# EasyEDA Pro project PRJ_Feeder.epro, schematic MainBoard

## Sheets
1 Power: Board Name: Feeder; Create Date: 2025-01-08; Page Name: Power; Project Name: Orion-Feeder; Schematic Name: MainBoard; Update Date: 2025-01-09; Company: EasyEDA.com; Page Size: A4; Version: V0.1b
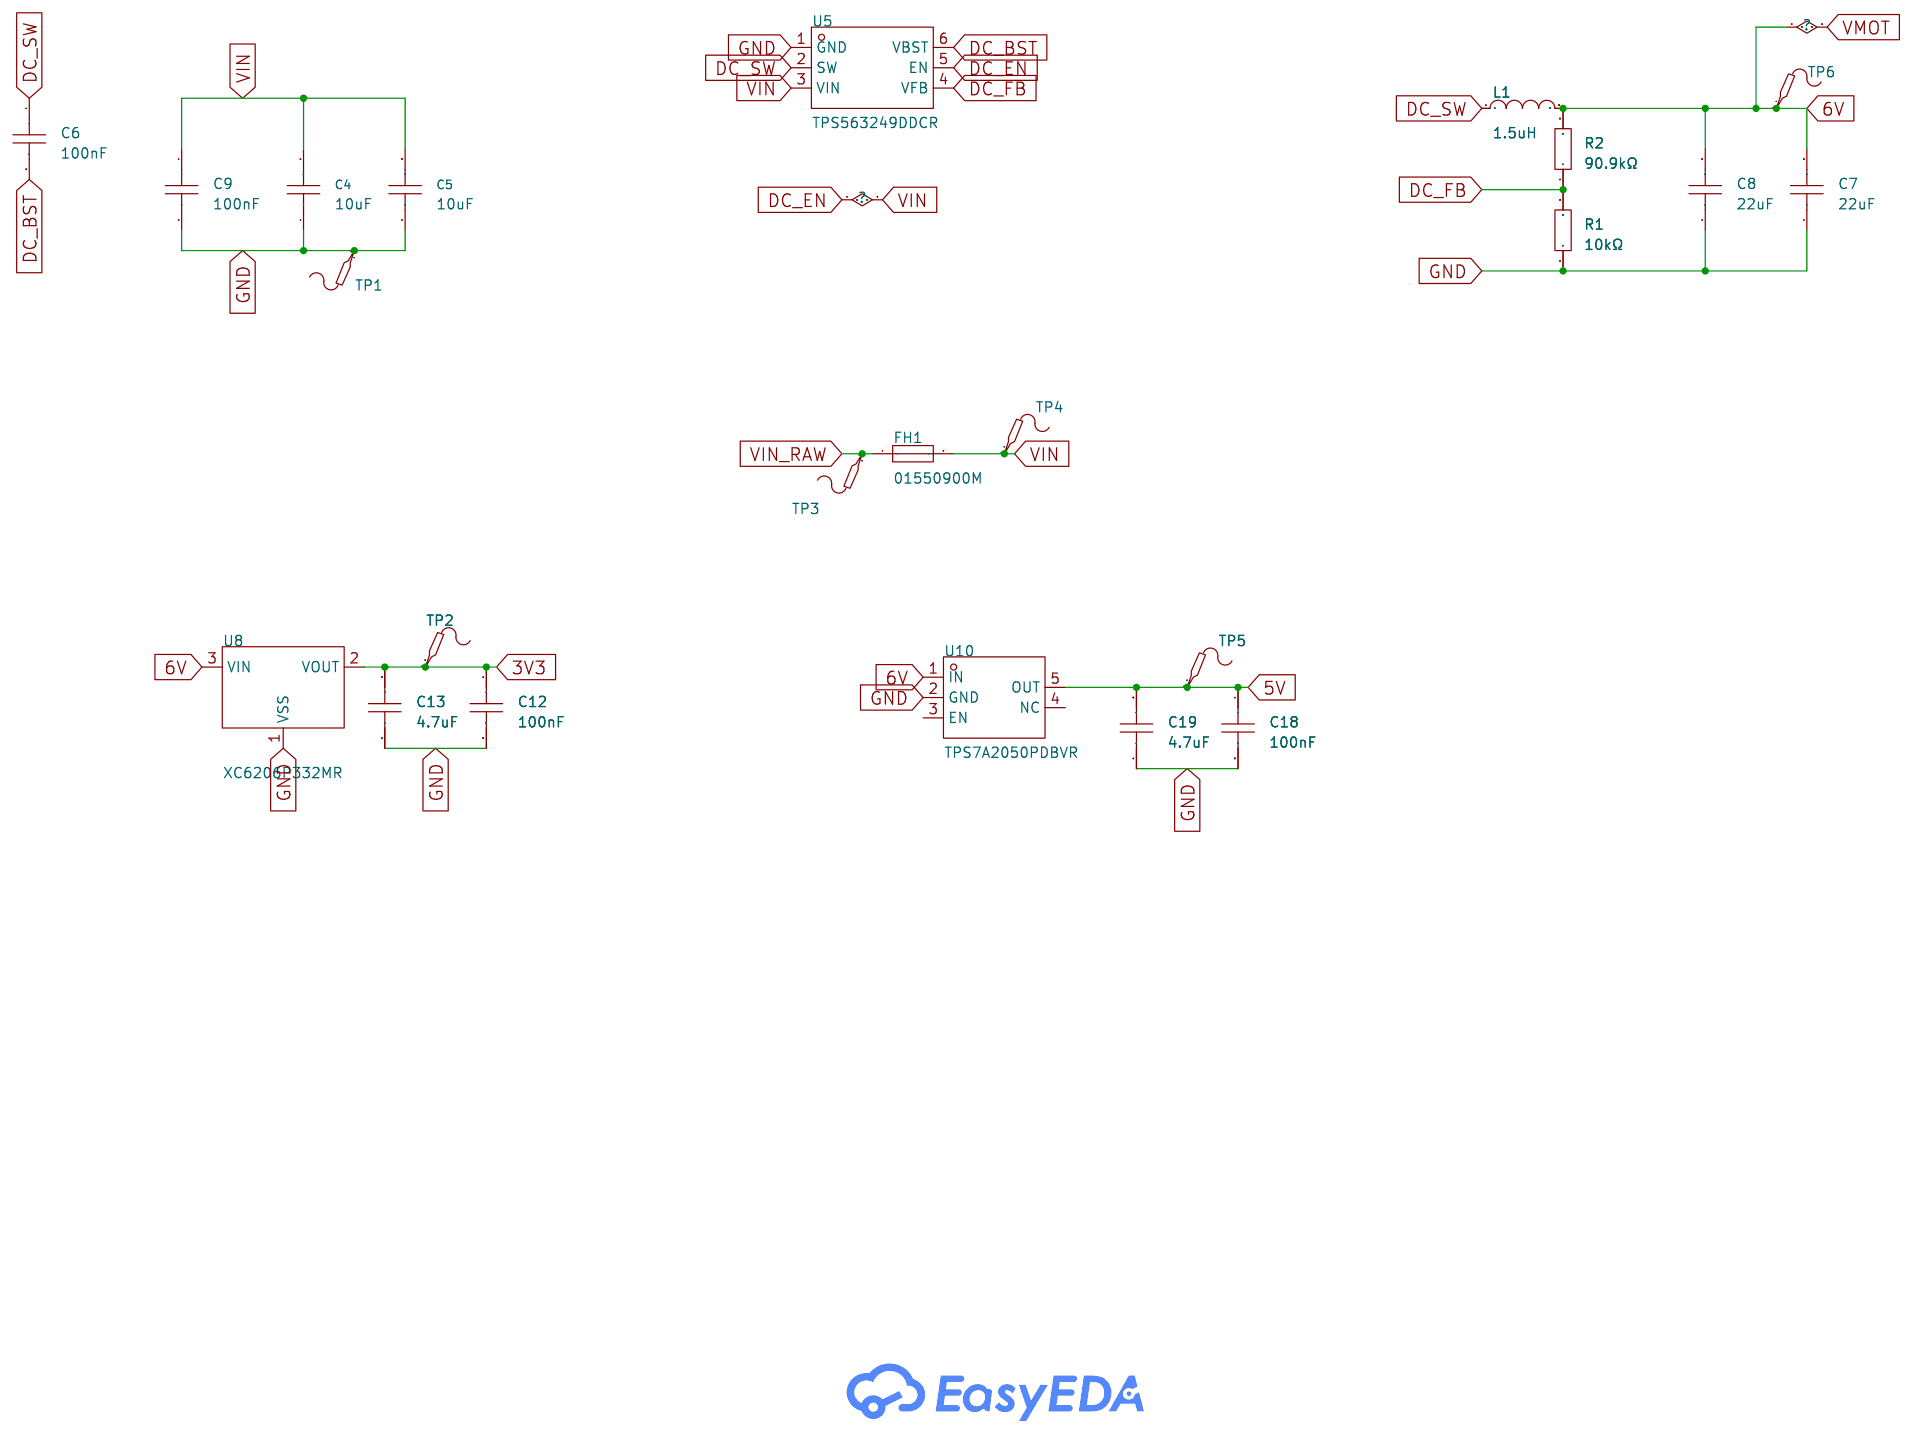
[diagram p0: Power]
2 MCU: Page Name: MCU
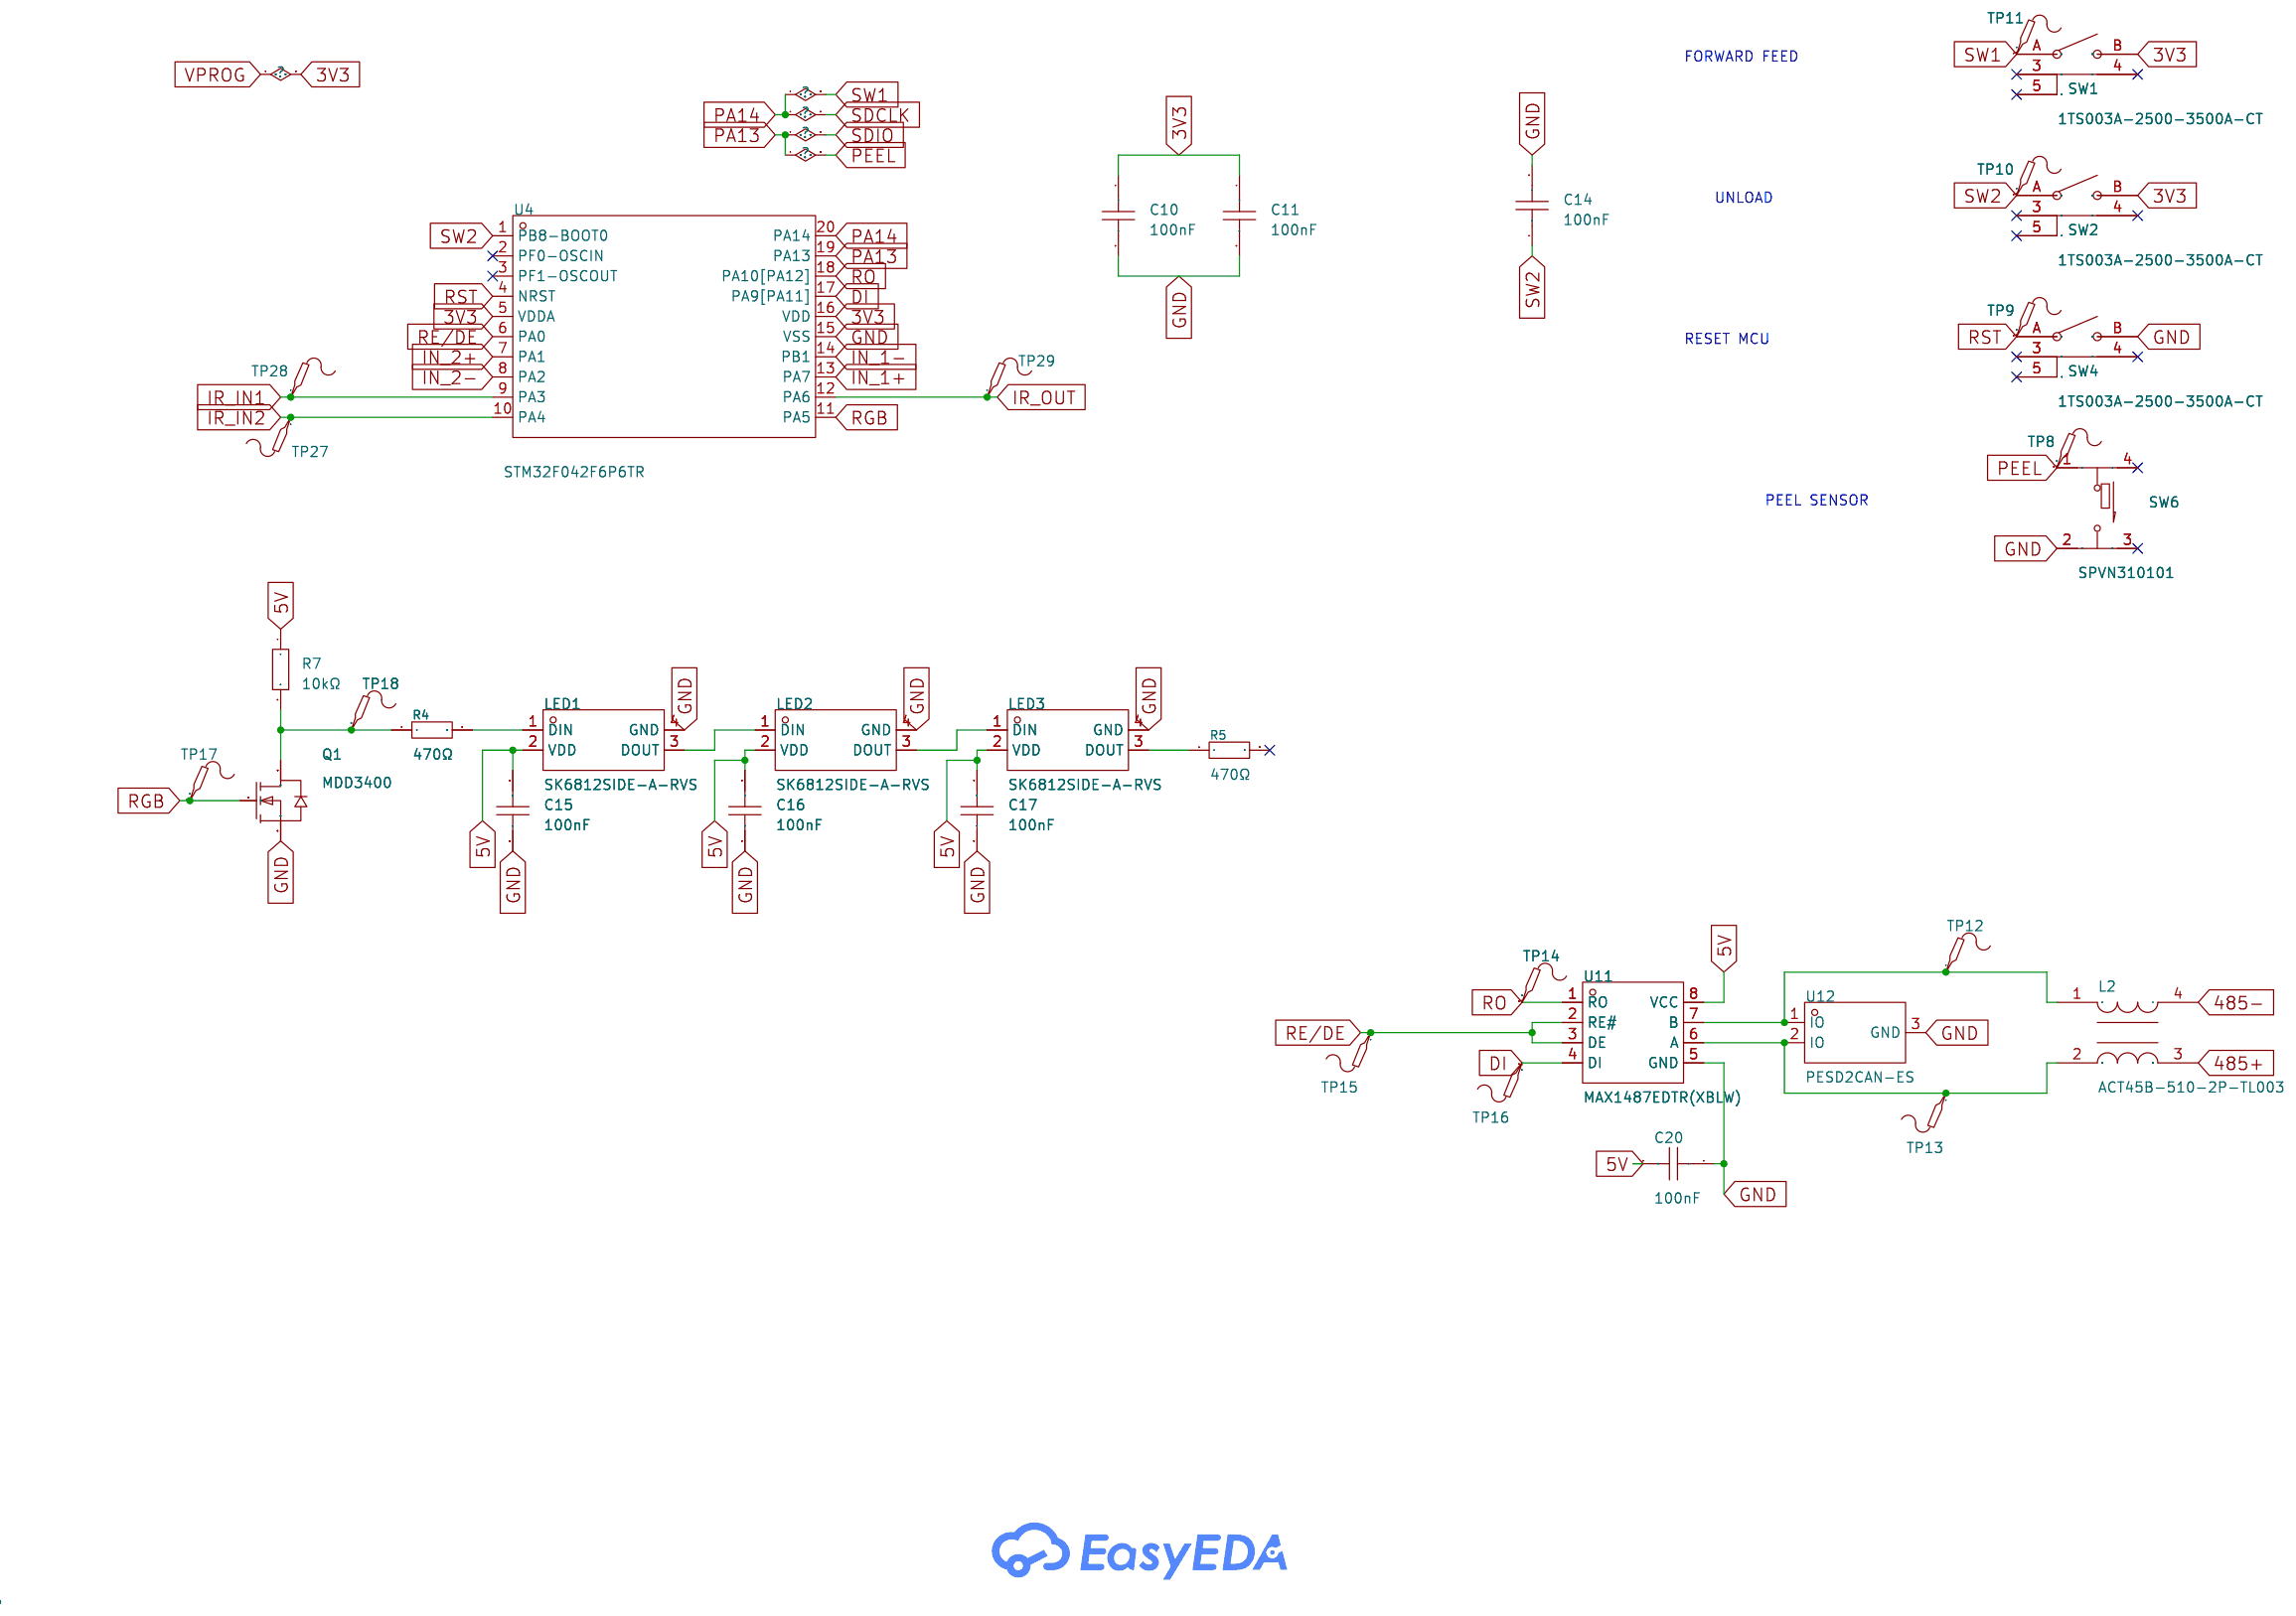
[diagram p1: MCU]
3 Motor: Page Name: Motor; Update Date: 2025-03-19
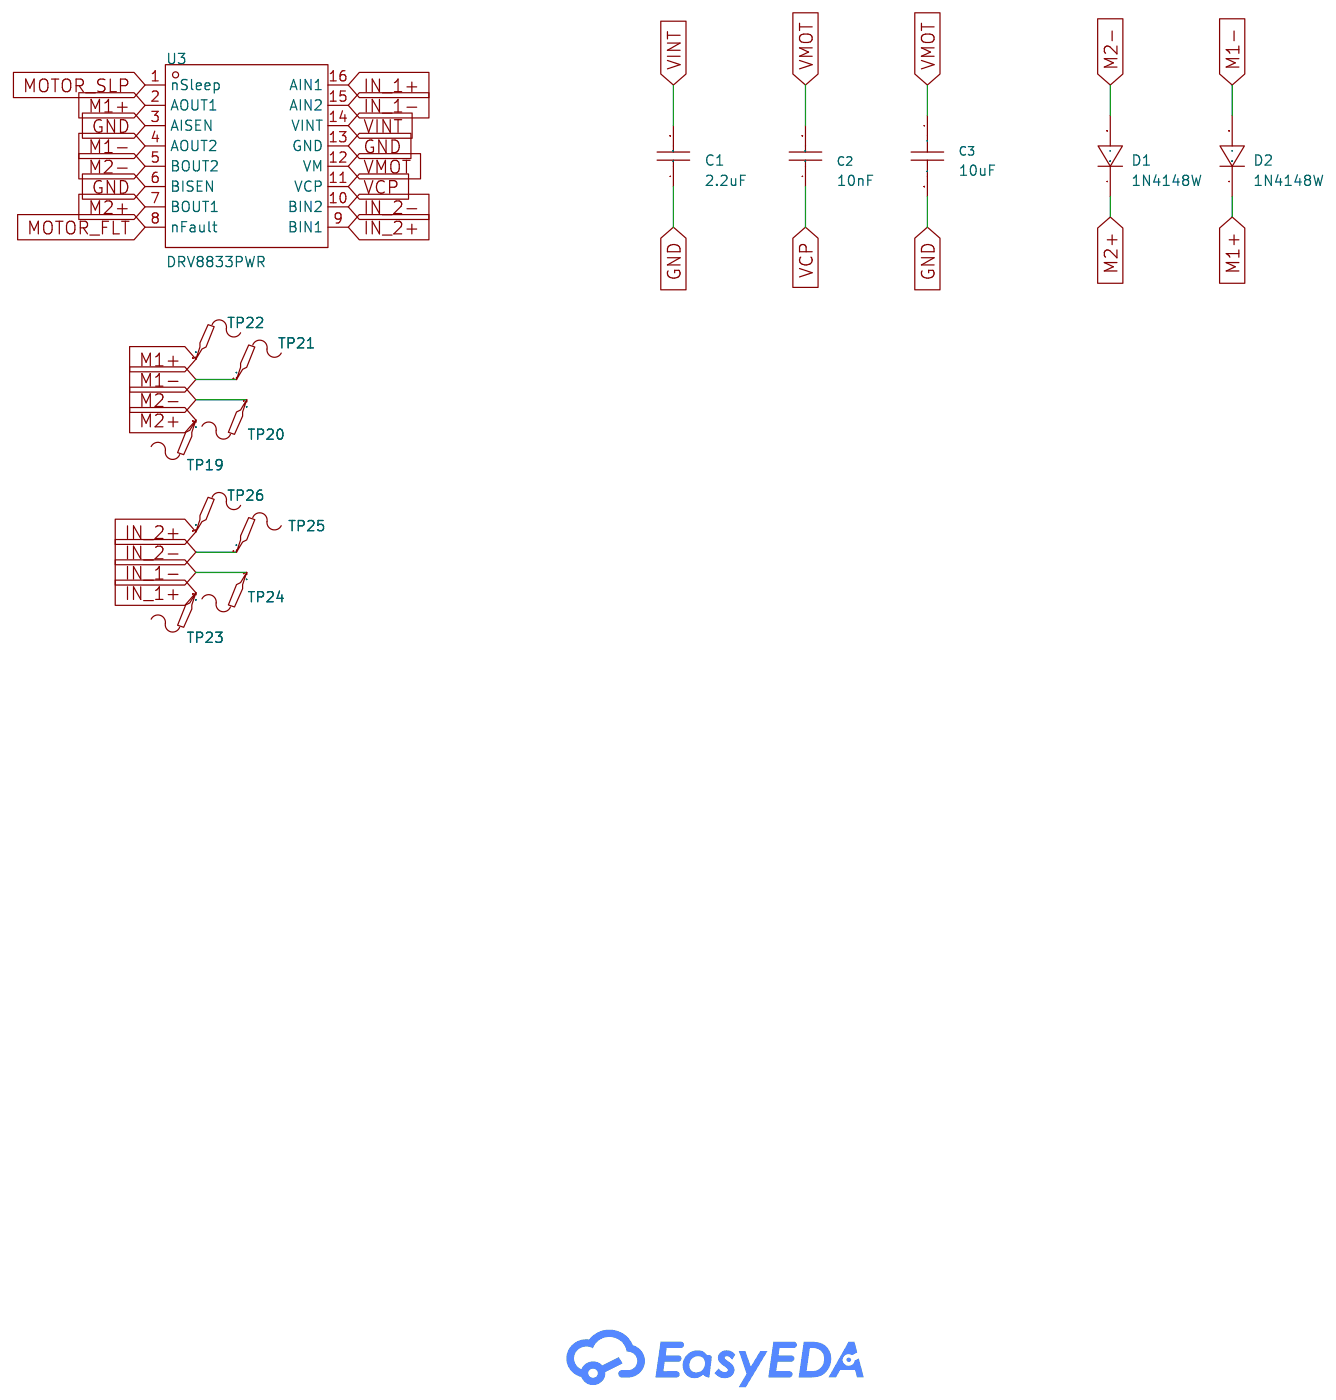
[diagram p2: Motor]
4 Connectors: Page Name: Connectors; Update Date: 2025-01-08
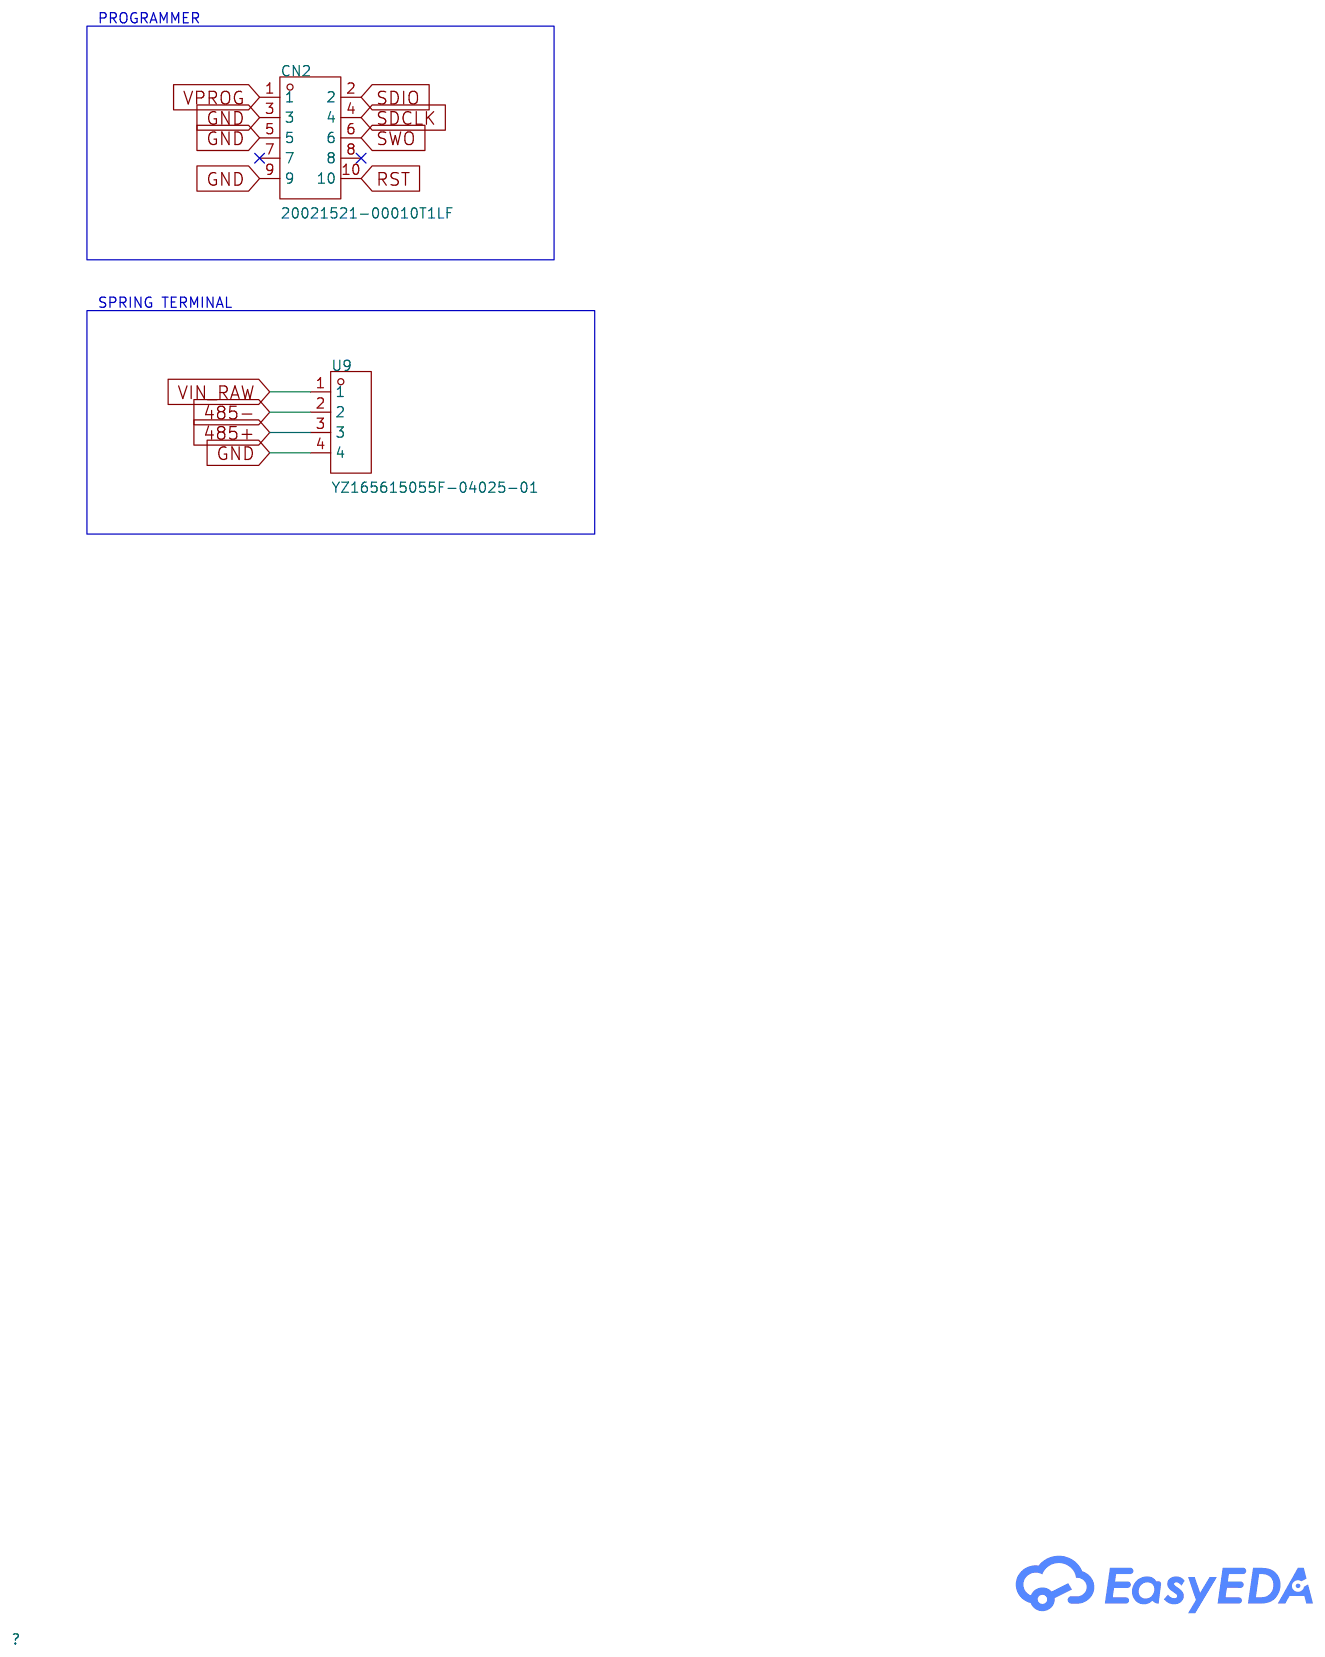
[diagram p3: Connectors]

## Parts
sheet Connectors
CN2  20021521-00010T1LF  [IDC-SMD_10P-P1.27_X1270WVS-2X05B-6TV01]
U9  YZ165615055F-04025-01  [CONN-SMD_4P-L11.0-W5.5-P2.50_YZ165615055F-04025-01]
sheet MCU
C10  100nF  [C0402]
C11  100nF  [C0402]
C14  100nF  [C0402]
C15  100nF  [C0402]
C16  100nF  [C0402]
C17  100nF  [C0402]
C20  100nF  [C0402]
L2  ACT45B-510-2P-TL003  [IND-SMD_4P-L4.5-W3.2-TL]
LED1  SK6812SIDE-A-RVS  [LED-SMD_4P-L4.0-W1.6-L]
LED2  SK6812SIDE-A-RVS  [LED-SMD_4P-L4.0-W1.6-L]
LED3  SK6812SIDE-A-RVS  [LED-SMD_4P-L4.0-W1.6-L]
Q1  MDD3400  [SOT-23-3_L2.9-W1.5-P1.90-LS2.6-BR]
R4  470Ω  [R0805]
R5  470Ω  [R0805]
R7  10kΩ  [R0402]
SW1  1TS003A-2500-3500A-CT  [SW-SMD_1TS003A-XXXX-3500A-CT]
SW2  1TS003A-2500-3500A-CT  [SW-SMD_1TS003A-XXXX-3500A-CT]
SW4  1TS003A-2500-3500A-CT  [SW-SMD_1TS003A-XXXX-3500A-CT]
SW6  SPVN310101  [SW-SMD_SPVN310101]
TP8  -  [Test-Point-0.5mm]
TP9  -  [Test-Point-0.5mm]
TP10  -  [Test-Point-0.5mm]
TP11  -  [Test-Point-0.5mm]
TP12  -  [Test-Point-0.5mm]
TP13  -  [Test-Point-0.5mm]
TP14  -  [Test-Point-0.5mm]
TP15  -  [Test-Point-0.5mm]
TP16  -  [Test-Point-0.5mm]
TP17  -  [Test-Point-0.5mm]
TP18  -  [Test-Point-0.5mm]
TP27  -  [Test-Point-0.5mm]
TP28  -  [Test-Point-0.5mm]
TP29  -  [Test-Point-0.5mm]
U4  STM32F042F6P6TR  [TSSOP-20_L6.5-W4.4-P0.65-LS6.4-BL]
U11  MAX1487EDTR(XBLW)  [SOP-8_L4.9-W3.9-P1.27-LS6.0-BL]
U12  PESD2CAN-ES  [SOT-23-3_L2.9-W1.3-P1.90-LS2.4-BR]
sheet Motor
C1  2.2uF  [C0805]
C2  10nF  [C0402]
C3  10uF  [C0603]
D1  1N4148W  [SOD-123_L2.8-W1.8-LS3.7-RD]
D2  1N4148W  [SOD-123_L2.8-W1.8-LS3.7-RD]
TP19  -  [Test-Point-0.5mm]
TP20  -  [Test-Point-0.5mm]
TP21  -  [Test-Point-0.5mm]
TP22  -  [Test-Point-0.5mm]
TP23  -  [Test-Point-0.5mm]
TP24  -  [Test-Point-0.5mm]
TP25  -  [Test-Point-0.5mm]
TP26  -  [Test-Point-0.5mm]
U3  DRV8833PWR  [TSSOP-16_L5.0-W4.4-P0.65-LS6.4-BL]
sheet Power
C4  10uF  [C0603]
C5  10uF  [C0603]
C6  100nF  [C0402]
C7  22uF  [C0402]
C8  22uF  [C0402]
C9  100nF  [C0402]
C12  100nF  [C0402]
C13  4.7uF  [C0402]
C18  100nF  [C0402]
C19  4.7uF  [C0402]
FH1  01550900M  [FUSE-SMD_L9.8-W5.0]
L1  1.5uH  [IND-SMD_L3.0-W3.0-LS3.65]
R1  10kΩ  [R0402]
R2  90.9kΩ  [R0402]
TP1  -  [Test-Point-0.5mm]
TP2  -  [Test-Point-0.5mm]
TP3  -  [Test-Point-0.5mm]
TP4  -  [Test-Point-0.5mm]
TP5  -  [Test-Point-0.5mm]
TP6  -  [Test-Point-0.5mm]
U5  TPS563249DDCR  [TSOT-23-6_L2.9-W1.6-P0.95-LS2.8-TL]
U8  XC6206P332MR  [SOT-23-3_L2.9-W1.3-P1.90-LS2.4-BR]
U10  TPS7A2050PDBVR  [SOT-23-5_L2.9-W1.6-P0.95-LS2.8-BR]

## Library data of the parts
CN2 = 20021521-00010T1LF: Number of Pins:10P Pitch:1.27mm Mounting Style:Standing paste Number of Rows:2 Current Rating (Max):- Operating Temperature Range:- Operating Temperature Range:-; LCSC Part Name: 间距:1.27mm PIN:10P 公 立贴; Supplier Part: C2972785; Manufacturer: Amphenol; Supplier Footprint: SMD,P=1.27mm; JLCPCB Part Class: Extended Part; Datasheet: https://atta.szlcsc.com/upload/public/pdf/source/20220418/3720F6CE576EEF3F058123D41D79595E.pdf; Supplier: LCSC; Number of Pins: 10P; Pitch: 1.27mm; Mounting Style: Standing paste; Number of Rows: 2
U9 = YZ165615055F-04025-01: Type:Spring loaded pin (POGO PIN) Number of Pins:Four-PIN Bit Pitch:2.5mm Overall Length/Height:5.5mm Operational Height:4mm Contact Resistance:50mΩ Elastic Life:10000 times Rated Current:1A Rated Voltage:12V Contact Material:Brass Contact Plating:Gold Op; LCSC Part Name: 侧贴弹簧顶针连接器; Supplier Part: C5296819; Manufacturer: Xinyangze(鑫扬泽); JLCPCB Part Class: Extended Part; Datasheet: https://atta.szlcsc.com/upload/public/pdf/source/20221209/5E85F3670C782BCF645AEF457C989CF7.pdf; Supplier: LCSC; Type: Spring loaded pin (POGO PIN); Number of Pins: Four-PIN Bit; Pitch: 2.5mm; Overall Length/Height: 5.5mm; Operational Height: 4mm; Contact Resistance: 50mΩ; Elastic Life: 10000 times; Rated Current: 1A; Rated Voltage: 12V; Contact Material: Brass; Contact Plating: Gold; Operating Temperature Range: -40℃~+85℃
C6 C9-C12 C14-C18 C20 = 0402X104K500CT: Capacitance: Tolerance:±10% Tolerance:±10% Voltage Rated: Temperature Coefficient:; LCSC Part Name: 100nF ±10% 50V; Supplier Part: C387959; Manufacturer: Walsin(华新科); Supplier Footprint: 0402; JLCPCB Part Class: Extended Part; Datasheet: https://atta.szlcsc.com/upload/public/pdf/source/20190524/C388053_0CD3F469255EF43E616A57DAC128F58D.pdf; Supplier: LCSC; Tolerance: ±10%
L2 = ACT45B-510-2P-TL003: Number of Lines:2 Withstanding Voltage:250V@2secs Current Rating:200mA Inductance @ Frequency:51uH@100kHz Voltage Rating - DC:50V Voltage Rating:- Impedance @ Frequency:2.8kΩ@10MHz DC Resistance (DCR):1Ω Operating Temperature:-40℃~+150℃ Operating Temperat; LCSC Part Name: 两路 4532共模滤波器 阻抗2.8kΩ@10MHz; Supplier Part: C76584; Manufacturer: TDK; Supplier Footprint: SMD,4.5x3.2mm; JLCPCB Part Class: Extended Part; Datasheet: https://atta.szlcsc.com/upload/public/pdf/source/20160918/1474166842057.pdf; Supplier: LCSC; Number of Lines: 2; Withstanding Voltage: 250V@2secs; Current Rating: 200mA; Inductance @ Frequency: 51uH@100kHz; Voltage Rating - DC: 50V; Impedance @ Frequency: 2.8kΩ@10MHz; DC Resistance (DCR): 1Ω; Operating Temperature: -40℃~+150℃
LED1-LED3 = SK6812SIDE-A-RVS: LCSC Part Name: RGB三色; Supplier Part: C2890037; Manufacturer: 欧思科光电; Supplier Footprint: SMD,2x4mm; JLCPCB Part Class: Extended Part; Datasheet: https://atta.szlcsc.com/upload/public/pdf/source/20210825/5EE39C41748E35606331A2C5A4C913B6.pdf; Supplier: LCSC
Q1 = MDD3400: Type:1 N-Channel Drain Source Voltage (Vdss): Continuous Drain Current (Id): Drain Source On Resistance (RDS(on)@Vgs,Id):27mΩ@10V Power Dissipation (Pd): Gate Threshold Voltage (Vgs(th)@Id):1.2V@250uA Total Gate Charge (Qg@Vgs):10.5nC@15V Input Capacitanc; LCSC Part Name: 1个N沟道 耐压:30V 电流:5.8A; Supplier Part: C427382; Manufacturer: MDD(辰达半导体); Supplier Footprint: SOT-23; JLCPCB Part Class: Extended Part; Datasheet: https://atta.szlcsc.com/upload/public/pdf/source/20240710/D763FFD6F9727D600913FEE933AEC681.pdf; Supplier: LCSC; Type: 1 N-Channel; Drain Source On Resistance (RDS(on)@Vgs,Id): 27mΩ@10V; Gate Threshold Voltage (Vgs(th)@Id): 1.2V@250uA; Total Gate Charge (Qg@Vgs): 10.5nC@15V; Input Capacitance (Ciss@Vds): 635pF@15V; Reverse Transfer Capacitance (Crss@Vds): 40pF; Operating Temperature: -50℃~+150℃
R4 R5 = 0805W8F4700T5E: Type:Thick Film Resistors Resistance: Tolerance:±1% Tolerance:±1% Power(Watts): Overload Voltage (Max): Temperature Coefficient:±100ppm/℃ Temperature Coefficient:±100ppm/℃ Operating Temperature Range:-55℃~+155℃ Operating Temperature Range:-55℃~+155℃; LCSC Part Name: 470Ω ±1% 125mW 厚膜电阻; Supplier Part: C17710; Manufacturer: UNI-ROYAL(厚声); Supplier Footprint: 0805; JLCPCB Part Class: Basic Part; Datasheet: https://atta.szlcsc.com/upload/public/pdf/source/20200306/C422600_1E6D84923E4A46A82E41ADD87F860B5C.pdf; Supplier: LCSC; Type: Thick Film Resistors; Tolerance: ±1%; Temperature Coefficient: ±100ppm/℃; Operating Temperature Range: -55℃~+155℃
R1 R7 = RC0402FR-0710KL: Type:Thick Film Resistors Resistance: Tolerance:±1% Tolerance:±1% Power(Watts): Overload Voltage (Max): Temperature Coefficient:±100ppm/℃ Temperature Coefficient:±100ppm/℃ Operating Temperature Range:-55℃~+155℃ Operating Temperature Range:-55℃~+155℃; LCSC Part Name: 厚膜电阻 10kΩ ±1% 62.5mW; Supplier Part: C60490; Manufacturer: YAGEO(国巨); Supplier Footprint: 0402; JLCPCB Part Class: Extended Part; Datasheet: https://atta.szlcsc.com/upload/public/pdf/source/20170925/C131467_1506321478108990263.pdf; Supplier: LCSC; Type: Thick Film Resistors; Tolerance: ±1%; Temperature Coefficient: ±100ppm/℃; Operating Temperature Range: -55℃~+155℃
SW1 SW2 SW4 = 1TS003A-2500-3500A-CT: Circuit:SPST Actuator Style:Rectangle button Operating Force:250gf Mounting Style:卧贴 Switch Length:4.6mm Switch Width:1.82mm Switch Height:3.5mm Strike Gundam:带支架 Contact Current:50mA Voltage Rating (DC):12V Power Rating:0.6W Insulation Resistance:100MΩ A; LCSC Part Name: 4.6*1.82*3.5mm 卧贴 轻触开关; Supplier Part: C255807; Manufacturer: HYP(鸿源精密); Supplier Footprint: SMD,2x4mm; JLCPCB Part Class: Extended Part; Datasheet: https://atta.szlcsc.com/upload/public/pdf/source/20180720/C255807_7E32288741BC460F190A5C520CB4BFB4.pdf; Supplier: LCSC; Circuit: SPST; Actuator Style: Rectangle button; Operating Force: 250gf; Mounting Style: 卧贴; Switch Length: 4.6mm; Switch Width: 1.82mm; Switch Height: 3.5mm; Strike Gundam: 带支架; Contact Current: 50mA; Voltage Rating (DC): 12V; Power Rating: 0.6W; Insulation Resistance: 100MΩ; Actuator/Cap Color: Black; With Lamp: No; Pin Style: J pin; Mechanical Life: 1.5万次; Operating Temperature: -40℃~+90℃
SW6 = SPVN310101: Circuit:SPST - normally open Contact Current (DC):1mA Voltage Rating (DC):5V Contact Current (AC):- Voltage Rating (AC):- Mechanical Life:-; Supplier Part: C255568; Manufacturer: ALPSALPINE(阿尔卑斯阿尔派); Supplier Footprint: SMD; JLCPCB Part Class: Extended Part; Datasheet: https://atta.szlcsc.com/upload/public/pdf/source/20180717/C255573_0C4B7CC88EAA9B9BBCA05F6FEC799EE3.pdf; Supplier: LCSC; Circuit: SPST - normally open; Contact Current (DC): 1mA; Voltage Rating (DC): 5V
TP1-TP6 TP8-TP29 = Test-Point: Test Point 测试点
U4 = STM32F042F6P6TR: CPU Core:ARM-M0 Program Storage Size:32KB GPIO Ports Number:16 Operating Voltage Range:1.65V~3.6V Operating Voltage Range:1.65V~3.6V CPU Maximum Speed:48MHz Operating Temperature Range:-40℃~+85℃ Operating Temperature Range:-40℃~+85℃ ADC (Bit):12bit Univer; LCSC Part Name: 主流ARM Cortex-M0 USB系列MCU，具有32 KB Flash、48 MHz CPU、USB、CAN和CEC功能; Supplier Part: C2969989; Manufacturer: ST(意法半导体); Supplier Footprint: TSSOP-20(4.4x6.5); JLCPCB Part Class: Extended Part; Datasheet: https://atta.szlcsc.com/upload/public/pdf/source/20180326/C88048_75CEBEF3F549B3F081FE2DB403271B9C.pdf; Supplier: LCSC; CPU Core: ARM-M0; Program Storage Size: 32KB; GPIO Ports Number: 16; Operating Voltage Range: 1.65V~3.6V; CPU Maximum Speed: 48MHz; Operating Temperature Range: -40℃~+85℃; ADC (Bit): 12bit; Universal Serial Bus: Yes; Watchdog: Yes; Infrared Data Association: Yes; Low-Voltage Detect: Yes; Direct Memory Access: Yes; Internal Oscillator: Yes
U11 = MAX1487EDTR(XBLW): LCSC Part Name: XBLW MAX1487 12 Mbps通信收发器; Supplier Part: C41369526; Manufacturer: XBLW(芯伯乐); Supplier Footprint: SOP-8; Datasheet: https://atta.szlcsc.com/upload/public/pdf/source/20240826/373ADB85BB75A28C97F383EDEA6A9A3C.pdf; Supplier: LCSC
U12 = PESD2CAN-ES: polarity:Bidirectional Reverse Stand-Off Voltage (Vrwm):24V Maximum Clamping Voltage:48V Peak Pulse Current (Ipp):8A Peak Pulse Power Dissipation (Ppp):450W Breakdown Voltage:26.5V Reverse Leakage Current (Ir):1uA Number of Lines:Dual channel Operating Te; LCSC Part Name: CAN 防护，两路双向ESD静电防护器件，30kV，CJ：15pF；CAN/CANFD/12V、24V电源防护; Supplier Part: C5180299; Manufacturer: ElecSuper(静芯微); Supplier Footprint: SOT-23; JLCPCB Part Class: Extended Part; Datasheet: https://atta.szlcsc.com/upload/public/pdf/source/20240905/8813EF6117DE3CA11E16DC4758DF48B3.pdf; Supplier: LCSC; polarity: Bidirectional; Reverse Stand-Off Voltage (Vrwm): 24V; Maximum Clamping Voltage: 48V; Peak Pulse Current (Ipp): 8A; Peak Pulse Power Dissipation (Ppp): 450W; Breakdown Voltage: 26.5V; Reverse Leakage Current (Ir): 1uA; Number of Lines: Dual channel; Type: ESD
C1 = CL21B225KOFNNNE: Capacitance: Tolerance:±10% Tolerance:±10% Voltage Rated: Temperature Coefficient:; LCSC Part Name: 2.2uF ±10% 16V; Supplier Part: C28234; Manufacturer: SAMSUNG(三星); Supplier Footprint: 0805; JLCPCB Part Class: Extended Part; Datasheet: https://atta.szlcsc.com/upload/public/pdf/source/20160218/1457707763339.pdf; Supplier: LCSC; Tolerance: ±10%
C2 = CC0402KRX7R9BB103: Capacitance: Tolerance:±10% Tolerance:±10% Voltage Rated: Temperature Coefficient:; LCSC Part Name: 10nF ±10% 50V; Supplier Part: C60133; Manufacturer: YAGEO(国巨); Supplier Footprint: 0402; JLCPCB Part Class: Extended Part; Datasheet: https://atta.szlcsc.com/upload/public/pdf/source/20180224/C181747_15194369449651363981.pdf; Supplier: LCSC; Tolerance: ±10%
C3-C5 = GRM188R61E106KA73D: Capacitance: Tolerance:±10% Tolerance:±10% Voltage Rated: Temperature Coefficient:; LCSC Part Name: 10uF ±10% 25V; Supplier Part: C344022; Manufacturer: muRata(村田); Supplier Footprint: 0603; JLCPCB Part Class: Extended Part; Datasheet: https://atta.szlcsc.com/upload/public/pdf/source/20181211/C344022_BB98D43E7DA95E5A749FBFE073C8A3E0.pdf; Supplier: LCSC; Tolerance: ±10%
D1 D2 = 1N4148W_C84367: Diode Configuration: Forward Voltage (Vf@If):1.5V@300mA Reverse Voltage (Vr): Rectified Current: Reverse Leakage Current:25nA@20V Reverse Recovery Time (trr): Operating Temperature:- Operating Temperature:-; LCSC Part Name: 电压:100V 电流:300mA; Supplier Part: C84367; Manufacturer: MDD(辰达半导体); Supplier Footprint: SOD-123; JLCPCB Part Class: Extended Part; Datasheet: https://atta.szlcsc.com/upload/public/pdf/source/20230823/B01BF36E6140A0359364F9F682D146D6.pdf; Supplier: LCSC; Forward Voltage (Vf@If): 1.5V@300mA; Reverse Leakage Current: 25nA@20V
U3 = DRV8833PWR: Supplier Part: C544801; Manufacturer: TI(德州仪器); Supplier Footprint: TSSOP-16; JLCPCB Part Class: Extended Part; Datasheet: https://www.ti.com/cn/lit/gpn/drv8833; Supplier: LCSC
C7 C8 = GRM158R61A226ME15D: Capacitance: Tolerance:±20% Tolerance:±20% Voltage Rated: Temperature Coefficient:; LCSC Part Name: 22uF ±20% 10V; Supplier Part: C3845593; Manufacturer: muRata(村田); Supplier Footprint: 0402; JLCPCB Part Class: Extended Part; Datasheet: https://atta.szlcsc.com/upload/public/pdf/source/20230811/016E9304DA64D47AB1EFBD6C89B0D146.pdf; Supplier: LCSC; Tolerance: ±20%
C13 C19 = GRM155R61E475ME15D: Capacitance: Voltage Rated: Temperature Coefficient:; LCSC Part Name: 4.7uF 25V; Supplier Part: C2858031; Manufacturer: muRata(村田); Supplier Footprint: 0402; JLCPCB Part Class: Extended Part; Datasheet: https://atta.szlcsc.com/upload/public/pdf/source/20170523/1495533985505.pdf; Supplier: LCSC
FH1 = 01550900M: Fuseholder Type:- Fuse Type:- Fuse Size:-; Supplier Part: C108518; Manufacturer: Littelfuse(美国力特); Supplier Footprint: SMD,5.0x9.7mm; JLCPCB Part Class: Extended Part; Datasheet: https://atta.szlcsc.com/upload/public/pdf/source/20181031/C315847_D8C8759CD5ED576C0EA975A2D5312378.pdf; Supplier: LCSC
L1 = IHLP1212BZER1R5M11: Inductance: Tolerance:±20% Tolerance:±20% Rated Current: Saturation Current (Isat):4A DC Resistance (DCR): Type:- Ratings:-; LCSC Part Name: 1.5uH ±20% 4A; Supplier Part: C844968; Manufacturer: VISHAY(威世); Supplier Footprint: 1212; JLCPCB Part Class: Extended Part; Datasheet: https://atta.szlcsc.com/upload/public/pdf/source/20231213/8EFBD0BF48E055EB7D0BC06A293AD7D7.pdf; Supplier: LCSC; Tolerance: ±20%; Saturation Current (Isat): 4A
R2 = RC0402FR-0790K9L: Type:Thick Film Resistors Resistance: Tolerance:±1% Tolerance:±1% Power(Watts): Overload Voltage (Max): Temperature Coefficient:±100ppm/℃ Temperature Coefficient:±100ppm/℃ Operating Temperature Range:-55℃~+155℃ Operating Temperature Range:-55℃~+155℃; LCSC Part Name: 厚膜电阻 90.9kΩ ±1% 62.5mW; Supplier Part: C163452; Manufacturer: YAGEO(国巨); Supplier Footprint: 0402; JLCPCB Part Class: Extended Part; Datasheet: https://atta.szlcsc.com/upload/public/pdf/source/20181009/C309620_DA5935B6E1D48212CB7A533FE518B3C2.pdf; Supplier: LCSC; Type: Thick Film Resistors; Tolerance: ±1%; Temperature Coefficient: ±100ppm/℃; Operating Temperature Range: -55℃~+155℃
U5 = TPS563249DDCR: Function:Step-down type Output Type:Adjustable Input Voltage:4.5V~17V Input Voltage:4.5V~17V Output Voltage:600mV~7V Output Voltage:600mV~7V Output Current:3A Switching Frequency:1.4MHz Switching Frequency:1.4MHz Operating Temperature:-40℃~+125℃@(TJ) Oper; Supplier Part: C2071915; Manufacturer: TI(德州仪器); Supplier Footprint: TSOT-23-6; JLCPCB Part Class: Extended Part; Datasheet: https://www.ti.com/cn/lit/gpn/tps563249; Supplier: LCSC; Function: Step-down type; Output Type: Adjustable; Input Voltage: 4.5V~17V; Output Voltage: 600mV~7V; Output Current: 3A; Switching Frequency: 1.4MHz; Operating Temperature: -40℃~+125℃@(TJ); Synchronous Rectification: Yes; Number of Outputs: 1; Topology: Step-down; Switch tube (built-in/external): Built-in
U8 = XC6206P332MR_C5148692: Output Type:Fixed Maximum Input Voltage:8V Output Voltage:3.3V Output Voltage:3.3V Output Current:300mA Dropout Voltage:240mV@(50mA) Feature:Short-Circuit  Protection；Overcurrent Protection(OCP) Output Polarity:Positive electrode Number of Outputs:1; LCSC Part Name: 输入8V 输出3.3V 300mA; Supplier Part: C5148692; Manufacturer: HXY MOSFET(华轩阳电子); Supplier Footprint: SOT-23; JLCPCB Part Class: Extended Part; Datasheet: https://atta.szlcsc.com/upload/public/pdf/source/20230315/7D5B35EFFBBF81C2EFC36318D2A1A670.pdf; Supplier: LCSC; Output Type: Fixed; Maximum Input Voltage: 8V; Output Voltage: 3.3V; Output Current: 300mA; Dropout Voltage: 240mV@(50mA); Feature: Short-Circuit  Protection；Overcurrent Protection(OCP); Output Polarity: Positive electrode; Number of Outputs: 1
U10 = TPS7A2050PDBVR: Output Type:Fixed Maximum Input Voltage:6V Output Voltage:5V Output Voltage:5V Output Current:300mA Dropout Voltage:140mV@(300mA) standby current:15uA Feature:ESD Protection；Soft Start；Surge Protection；Low ESR；Thermal Protection(TSD)；Under-voltage Lockout; LCSC Part Name: 具有高 PSRR 的 300mA、超低噪声、低 IQ、低压降 (LDO) 线性稳压器; Supplier Part: C2864504; Manufacturer: TI(德州仪器); Supplier Footprint: SOT-23-5; JLCPCB Part Class: Extended Part; Datasheet: http://www.ti.com/cn/lit/gpn/tps7a20; Supplier: LCSC; Output Type: Fixed; Maximum Input Voltage: 6V; Output Voltage: 5V; Output Current: 300mA; Dropout Voltage: 140mV@(300mA); standby current: 15uA; Feature: ESD Protection；Soft Start；Surge Protection；Low ESR；Thermal Protection(TSD)；Under-voltage Lockout；Overcurrent Protection(OCP)；With ability；Anti-Siphon; Operating Temperature: -40℃~+125℃@(Tj); Output Polarity: Positive electrode; Number of Outputs: 1

## Nets
3V3: C10.1 C11.1 C12.1 C13.2 CN2.1 SW1.B SW2.B TP2.1 U4.5(VDDA) U4.16(VDD) U8.2(VOUT)
5V: C15.1 C16.1 C17.1 C18.1 C19.2 C20.2 LED1.2(VDD) LED2.2(VDD) LED3.2(VDD) R7.1 TP5.1 U10.5(OUT) U11.8(VCC)
6V: C2.2 C3.1 C7.2 C8.2 L1.2 R2.2 TP6.1 U3.12(VM) U8.3(VIN) U10.1(IN)
GND: C1.1 C3.2 C4.1 C5.1 C7.1 C8.1 C9.2 C10.2 C11.2 C12.2 C13.1 C14.2 C15.2 C16.2 C17.2 C18.2 C19.1 C20.1 CN2.3 CN2.5 CN2.9 LED1.4(GND) LED2.4(GND) LED3.4(GND) Q1.2(S) R1.1 SW4.B SW6.2 TP1.1 U3.3(AISEN) U3.6(BISEN) U3.13(GND) U4.15(VSS) U5.1(GND) U8.1(VSS) U9.4 U10.2(GND) U11.5(GND) U12.3(GND)
VIN_RAW: FH1.1 TP3.1 U9.1
VINT: C1.2 U3.14(VINT)
485+: L2.3 U9.3
485-: L2.4 U9.2
DC_BST: C6.2 U5.6(VBST)
DC_EN: C4.2 C5.2 C9.1 FH1.2 TP4.1 U5.3(VIN) U5.5(EN)
DC_FB: R1.2 R2.1 U5.4(VFB)
DC_SW: C6.1 L1.1 U5.2(SW)
DI: TP16.1 U4.17(PA9[PA11]) U11.4(DI)
IN_1+: TP23.1 U3.16(AIN1) U4.13(PA7)
IN_1-: TP24.1 U3.15(AIN2) U4.14(PB1)
IN_2+: TP26.1 U3.9(BIN1) U4.7(PA1)
IN_2-: TP25.1 U3.10(BIN2) U4.8(PA2)
IR_IN1: TP28.1 U4.9(PA3)
IR_IN2: TP27.1 U4.10(PA4)
IR_OUT: TP29.1 U4.12(PA6)
M1+: D2.1(C) TP22.1 U3.2(AOUT1)
M1-: D2.2(A) TP21.1 U3.4(AOUT2)
M2+: D1.1(C) TP19.1 U3.7(BOUT1)
M2-: D1.2(A) TP20.1 U3.5(BOUT2)
MOTOR_FLT: U3.8(nFault)
MOTOR_SLP: U3.1(nSleep)
PA13: CN2.2 SW6.1 TP8.1 U4.19(PA13)
PA14: CN2.4 SW1.A TP11.1 U4.20(PA14)
RE/DE: TP15.1 U4.6(PA0) U11.2(RE#) U11.3(DE)
RGB: Q1.1(G) TP17.1 U4.11(PA5)
RO: TP14.1 U4.18(PA10[PA12]) U11.1(RO)
RST: CN2.10 SW4.A TP9.1 U4.4(NRST)
SW2: C14.1 SW2.A TP10.1 U4.1(PB8-BOOT0)
SWO: CN2.6
VCP: C2.1 U3.11(VCP)
$2N2838: LED1.3(DOUT) LED2.1(DIN)
$2N2847: LED2.3(DOUT) LED3.1(DIN)
$2N2968: LED3.3(DOUT) R5.1
$2N2973: LED1.1(DIN) R4.2
$2N2985: Q1.3(D) R4.1 R7.2 TP18.1
$2N3597: L2.2 TP13.1 U11.6(A) U12.2(IO)
$2N3600: L2.1 TP12.1 U11.7(B) U12.1(IO)

Not connected (* = marked no-connect by the designer): CN2 7* 8*; R5 2*; SW1 3* 4* 5*; SW2 3* 4* 5*; SW4 3* 4* 5*; SW6 3* 4*; U4 2(PF0-OSCIN)* 3(PF1-OSCOUT)*; U10 3(EN) 4(NC)

## Notes on the sheets
sheet 2
- FORWARD FEED
- UNLOAD
- RESET MCU
- PEEL SENSOR
sheet 4
- PROGRAMMER
- SPRING TERMINAL
